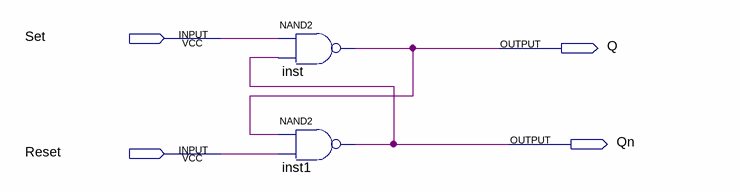
[diagram p0: schematic sheet]
// Quartus schematic SR_latch.bdf as structural Verilog: 2 symbols, 4 pins
module SR_latch (
  input  Set,
  input  Reset,
  output Q,
  output Qn
);

  nand inst (Q, Set, Qn);
  nand inst1 (Qn, Q, Reset);
endmodule
